# Altium schematic sheet Automotive Connector.SchDoc
size A4
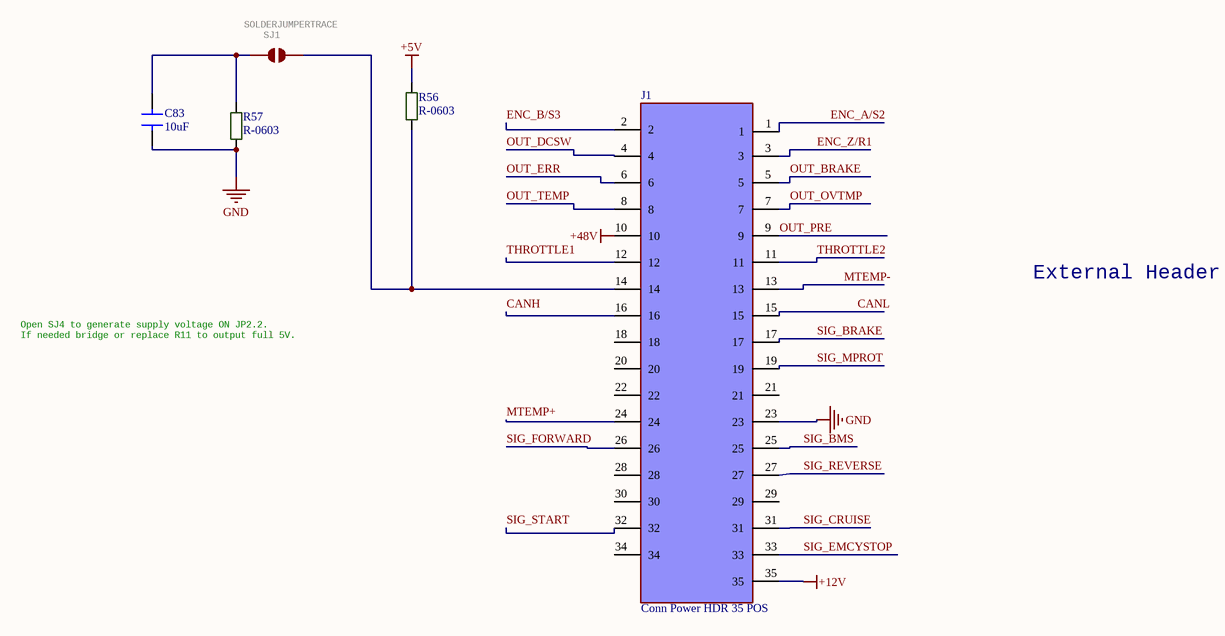
[diagram p0: Automotive Connector.SchDoc]

## Parts
C83  10uF  [C-0805]
J1  Conn Power HDR 35 POS  [TE_776230-2]
R56  R-0603  [R-0603R]
R57  R-0603  [R-0603R]
SJ1  SOLDERJUMPERTRACE  [SJ_2S-TRACE]

## Nets
+5V: R56.2
+12V: J1.35
+48V: J1.10
GND: C83.1 J1.23 R57.1
CANH: J1.16
CANL: J1.15
ENC_A/S2: J1.1
ENC_B/S3: J1.2
ENC_Z/R1: J1.3
MTEMP+: J1.24
MTEMP-: J1.13
OUT_BRAKE: J1.5
OUT_DCSW: J1.4
OUT_ERR: J1.6
OUT_OVTMP: J1.7
OUT_PRE: J1.9
OUT_TEMP: J1.8
SIG_BMS: J1.25
SIG_BRAKE: J1.17
SIG_CRUISE: J1.31
SIG_EMCYSTOP: J1.33
SIG_FORWARD: J1.26
SIG_MPROT: J1.19
SIG_REVERSE: J1.27
SIG_START: J1.32
THROTTLE1: J1.12
THROTTLE2: J1.11
NetC83_2: C83.2 R57.2 SJ1.1
NetJ1_14: J1.14 R56.1 SJ1.2

Not connected (* = marked no-connect by the designer): J1 18 20 21 22 28 29 30 34

## Notes on the sheet
- External Header
- Open SJ4 to generate supply voltage ON JP2.2.
  If needed bridge or replace R11 to output full 5V.

## Library data of the parts
C83 = C-0805
J1 = Conn Power HDR 35 POS: Conn Power HDR 35 POS 4mm Solder ST Thru-Hole 35 Terminal 1 Port Automotive Loose; MP: 776230-2; MF: TE Connectivity; Package: None; EU_RoHS_Compliance: Compliant; DigiKey-Purchase-URL: https://snapeda.com/shop?store=DigiKey&id=1466385; Value: *; Availability: Unavailable; Price: None; SnapEDA_Link: https://www.snapeda.com/parts/776230-2/TE%20Connectivity%20AMP%20Connectors/view-part/1466385/?ref=snap
SJ1 = SOLDERJUMPERTRACE: Solder JumperStandard SMD solder jumper. Used to automate production. Two varients : Normally Open and Normally Closed are the same, but have different paste layers. NC will have a large amount of paste and should jumper during reflow.; GateName_1: 1; SymbolName_1: SJ; DeviceName: TRACE; LibraryName: SparkFun-Passives; DeviceSetName: SOLDERJUMPER